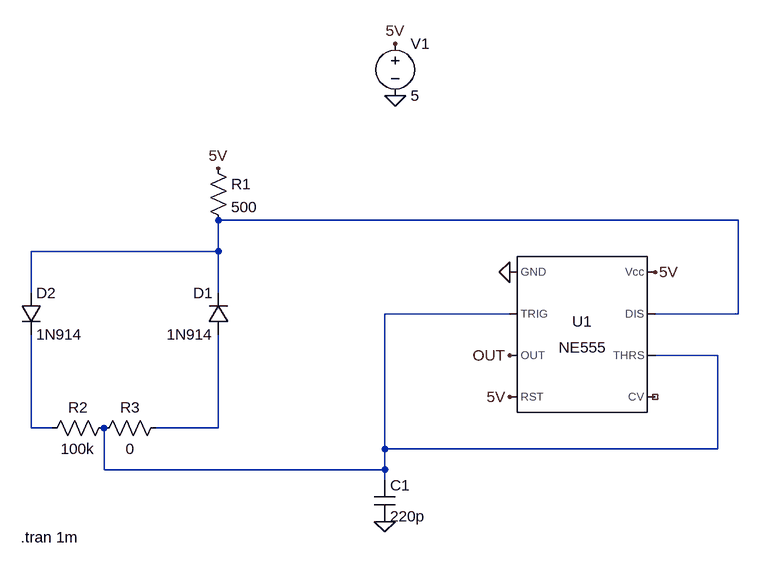
[diagram p0: schematic pwm.asc]
pwm.asc, the LTspice schematic file:
Version 4.1
SHEET 1 880 680
WIRE 464 -16 -336 -16
WIRE -336 32 -336 -16
WIRE -336 32 -624 32
WIRE -624 96 -624 32
WIRE -336 96 -336 32
WIRE 112 128 -80 128
WIRE 464 128 464 -16
WIRE 464 128 336 128
WIRE 432 192 336 192
WIRE -624 304 -624 160
WIRE -592 304 -624 304
WIRE -336 304 -336 160
WIRE -336 304 -432 304
WIRE -80 336 -80 128
WIRE 432 336 432 192
WIRE 432 336 -80 336
WIRE -512 368 -512 304
WIRE -80 368 -80 336
WIRE -80 368 -512 368
WIRE -80 384 -80 368
FLAG -64 -208 0
FLAG -64 -288 5V
FLAG 336 64 5V
FLAG -80 448 0
FLAG 112 256 5V
FLAG 112 192 OUT
FLAG 112 64 0
FLAG -336 -96 5V
SYMBOL Misc\\NE555 224 160 R0
SYMATTR InstName U1
SYMBOL voltage -64 -304 R0
WINDOW 123 0 0 Left 0
WINDOW 39 0 0 Left 0
SYMATTR InstName V1
SYMATTR Value 5
SYMBOL cap -96 384 R0
SYMATTR InstName C1
SYMATTR Value 220p
SYMBOL res -352 -112 R0
SYMATTR InstName R1
SYMATTR Value 500
SYMBOL diode -320 160 R180
WINDOW 0 24 64 Left 2
WINDOW 3 24 0 Left 2
SYMATTR InstName D1
SYMATTR Value 1N914
SYMBOL diode -640 96 R0
SYMATTR InstName D2
SYMATTR Value 1N914
SYMBOL res -496 288 R90
WINDOW 0 0 56 VBottom 2
WINDOW 3 32 56 VTop 2
SYMATTR InstName R2
SYMATTR Value 100k
SYMBOL res -416 288 R90
WINDOW 0 0 56 VBottom 2
WINDOW 3 32 56 VTop 2
SYMATTR InstName R3
SYMATTR Value 0
TEXT -640 472 Left 2 !.tran 1m

The netlist it stands for:
* pwm.asc
X§U1 0 N002 OUT 5V NC_01 N002 N001 5V NE555  ; pins GND TRIG OUT RST CV THRS DIS Vcc
V1 5V 0 5
C1 N002 0 220p
R1 5V N001 500
D1 N004 N001 1N914
D2 N001 N003 1N914
R2 N002 N003 100k
R3 N004 N002 0
.model D D
.lib standard.dio
.tran 1m
.lib NE555.sub
.backanno
.end